# Altium schematic sheet Amp_schem.SchDoc
size A3; SheetNumber: 1; SheetTotal: 1
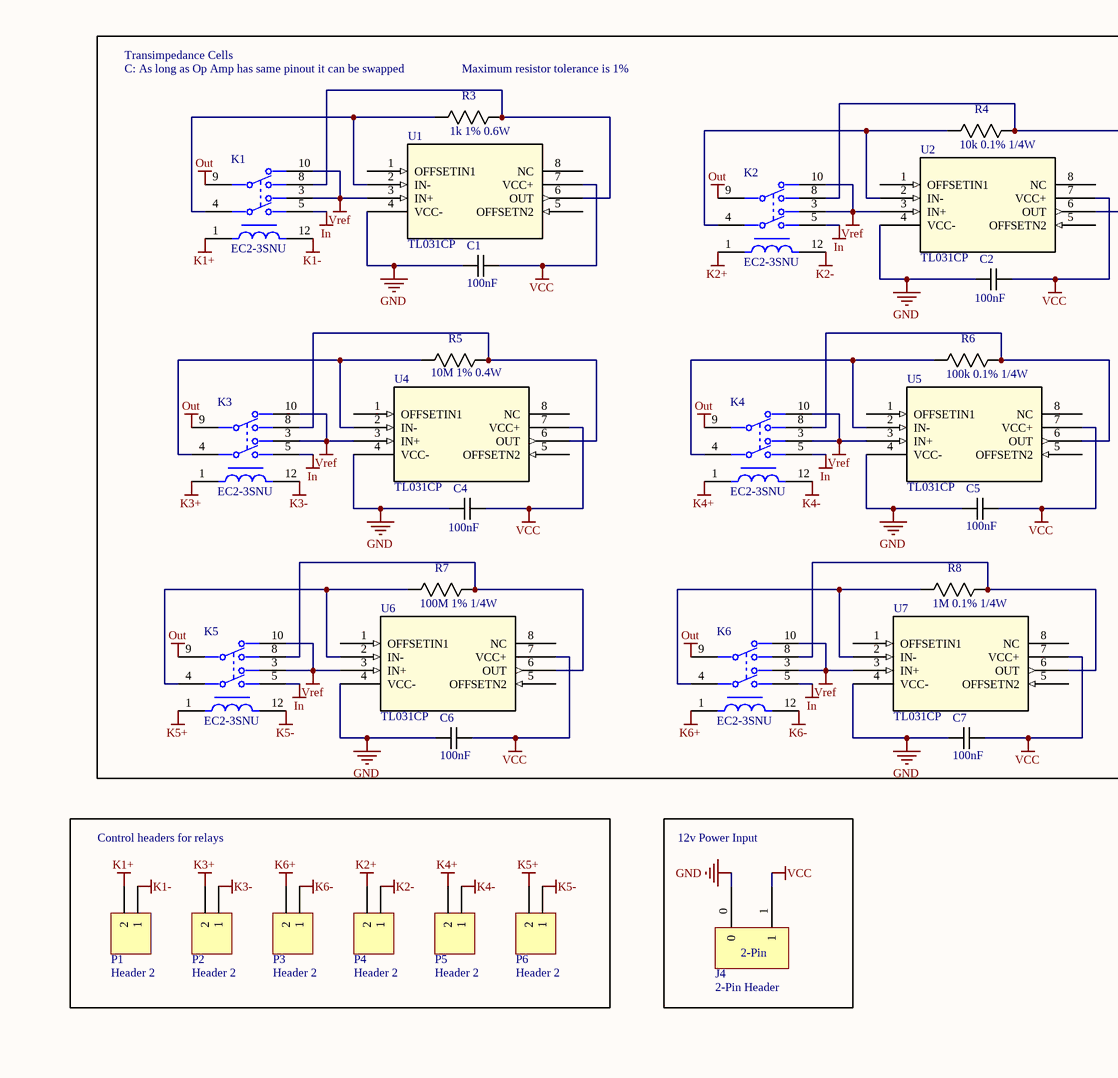
[diagram p0: Amp_schem.SchDoc, top left]
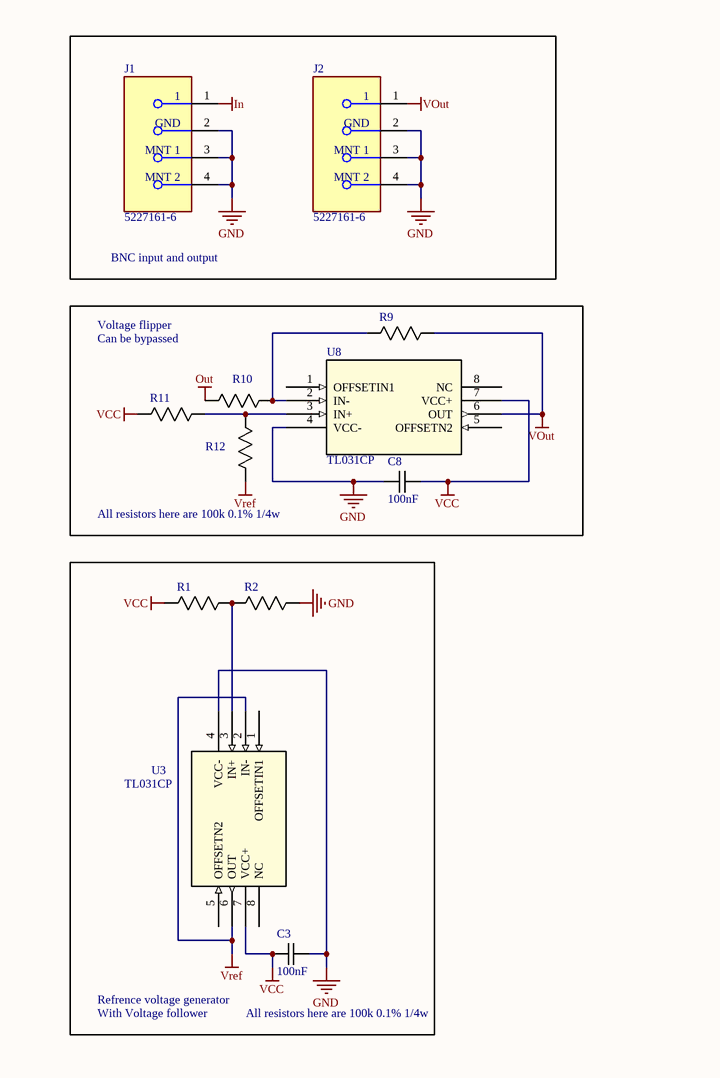
[diagram p1: Amp_schem.SchDoc, top right]
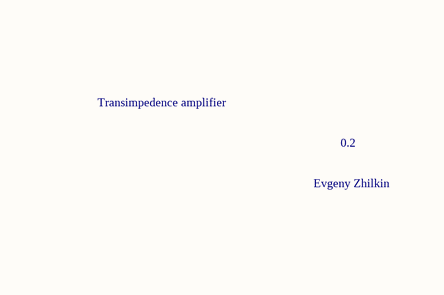
[diagram p2: Amp_schem.SchDoc, bottom right]

## Parts
C1  100nF  [Resistor 1/4]
C2  100nF  [Resistor 1/4]
C3  100nF  [Resistor 1/4]
C4  100nF  [Resistor 1/4]
C5  100nF  [Resistor 1/4]
C6  100nF  [Resistor 1/4]
C7  100nF  [Resistor 1/4]
C8  100nF  [Resistor 1/4]
J1  5227161-6  [FP-5227161-6-MFG]
J2  5227161-6  [FP-5227161-6-MFG]
J4  2-Pin Header  [HDR1X2]
K1  EC2-3SNU  [Relay]
K2  EC2-3SNU  [Relay]
K3  EC2-3SNU  [Relay]
K4  EC2-3SNU  [Relay]
K5  EC2-3SNU  [Relay]
K6  EC2-3SNU  [Relay]
P1  Header 2  [HDR1X2]
P2  Header 2  [HDR1X2]
P3  Header 2  [HDR1X2]
P4  Header 2  [HDR1X2]
P5  Header 2  [HDR1X2]
P6  Header 2  [HDR1X2]
R1  100k 0.1% 1/4w  [Resistor 0.4W]  (value not drawn)
R2  100k 0.1% 1/4w  [Resistor 0.4W]  (value not drawn)
R3  1k 1% 0.6W  [Resistor 0.4W]
R4  10k 0.1% 1/4W  [Resistor 0.4W]
R5  10M 1% 0.4W  [Resistor 0.4W]
R6  100k 0.1% 1/4W  [Resistor 0.4W]
R7  100M 1% 1/4W  [Resistor 0.4W]
R8  1M 0.1% 1/4W  [Resistor 0.4W]
R9  100k 0.1% 1/4w  [Resistor 0.4W]  (value not drawn)
R10  100k 0.1% 1/4w  [Resistor 0.4W]  (value not drawn)
R11  100k 0.1% 1/4w  [Resistor 0.4W]  (value not drawn)
R12  100k 0.1% 1/4w  [Resistor 0.4W]  (value not drawn)
U1  TL031CP  [P8]
U2  TL031CP  [P8]
U3  TL031CP  [P8]
U4  TL031CP  [P8]
U5  TL031CP  [P8]
U6  TL031CP  [P8]
U7  TL031CP  [P8]
U8  TL031CP  [P8]

## Blocks framed on the sheet
BNC input and output: J1 J2
Control headers for relays: P1-P6
12v Power Input: J4

## Nets
GND: C1.1 C2.1 C3.2 C4.1 C5.1 C6.1 C7.1 C8.1 J1.2(GND) J1.3(MNT_1) J1.4(MNT_2) J2.2(GND) J2.3(MNT_1) J2.4(MNT_2) J4.0 R2.2 U1.4(VCC-) U2.4(VCC-) U3.4(VCC-) U4.4(VCC-) U5.4(VCC-) U6.4(VCC-) U7.4(VCC-) U8.4(VCC-)
In: J1.1 K1.5 K2.5 K3.5 K4.5 K5.5 K6.5
K1+: K1.1 P1.2
K1-: K1.12 P1.1
K2+: K2.1 P4.2
K2-: K2.12 P4.1
K3+: K3.1 P2.2
K3-: K3.12 P2.1
K4+: K4.1 P5.2
K4-: K4.12 P5.1
K5+: K5.1 P6.2
K5-: K5.12 P6.1
K6+: K6.1 P3.2
K6-: K6.12 P3.1
Out: K1.9 K2.9 K3.9 K4.9 K5.9 K6.9 R10.1
VCC: C1.2 C2.2 C3.1 C4.2 C5.2 C6.2 C7.2 C8.2 J4.1 R1.1 R11.1 U1.7(VCC+) U2.7(VCC+) U3.7(VCC+) U4.7(VCC+) U5.7(VCC+) U6.7(VCC+) U7.7(VCC+) U8.7(VCC+)
VOut: J2.1 R9.2 U8.6(OUT)
Vref: K1.3 K1.10 K2.3 K2.10 K3.3 K3.10 K4.3 K4.10 K5.3 K5.10 K6.3 K6.10 R12.1 U1.3(IN+) U2.3(IN+) U3.2(IN-) U3.6(OUT) U4.3(IN+) U5.3(IN+) U6.3(IN+) U7.3(IN+)
NetK1_4: K1.4 R3.1 U1.2(IN-)
NetK1_8: K1.8 R3.2 U1.6(OUT)
NetK2_4: K2.4 R4.1 U2.2(IN-)
NetK2_8: K2.8 R4.2 U2.6(OUT)
NetK3_4: K3.4 R5.1 U4.2(IN-)
NetK3_8: K3.8 R5.2 U4.6(OUT)
NetK4_4: K4.4 R6.1 U5.2(IN-)
NetK4_8: K4.8 R6.2 U5.6(OUT)
NetK5_4: K5.4 R7.1 U6.2(IN-)
NetK5_8: K5.8 R7.2 U6.6(OUT)
NetK6_4: K6.4 R8.1 U7.2(IN-)
NetK6_8: K6.8 R8.2 U7.6(OUT)
NetR1_2: R1.2 R2.1 U3.3(IN+)
NetR9_1: R9.1 R10.2 U8.2(IN-)
NetR11_2: R11.2 R12.2 U8.3(IN+)

Not connected (* = marked no-connect by the designer): U1 1(OFFSETIN1) 5(OFFSETN2) 8(NC); U2 1(OFFSETIN1) 5(OFFSETN2) 8(NC); U3 1(OFFSETIN1) 5(OFFSETN2) 8(NC); U4 1(OFFSETIN1) 5(OFFSETN2) 8(NC); U5 1(OFFSETIN1) 5(OFFSETN2) 8(NC); U6 1(OFFSETIN1) 5(OFFSETN2) 8(NC); U7 1(OFFSETIN1) 5(OFFSETN2) 8(NC); U8 1(OFFSETIN1) 5(OFFSETN2) 8(NC)

## Notes on the sheet
- Transimpedance Cells
- (near R3) C: As long as Op Amp has same pinout it can be swapped
- (near R3) Maximum resistor tolerance is 1%
- Voltage flipper
- Can be bypassed
- (near R12) All resistors here are 100k 0.1% 1/4w
- (near C3) Refrence voltage generator
- With Voltage follower
- All resistors here are 100k 0.1% 1/4w
- Transimpedence amplifier
- 0.2
- Evgeny Zhilkin
- (in symbol 2-Pin Header) 2-Pin

## Library data of the parts
C1-C8 = Cap
J1 J2 = CMP-03790-39546762-1: 5227161-6 RF Connector, BNC, Jack, 50 Ohm, Right Angle PCB Mount, Commecial Grade; Manufacturer Lifecycle Status: ACTIVE; Insulation Resistance: 5GΩ; Sealable: No; Max Frequency: 4GHz; Body Plating: Nickel; Dielectric Material: Polymethylpentene; Tail Length: 4.11mm; Number of Positions: 1; Polarity: Normal, Standard; Body Material: Zinc; Voltage Rating: 500V; Gender: Female; Impedance: 50Ω; Outside Diameter: 14.529mm; Lifecycle Status: Production; Orientation: Right Angle; Mount: Panel; Packaging: Bulk; Frequency: 4GHz; Color: Black; Height: 16.13mm; NexarPartId: 39546762; Lead Free: Lead Free; Termination: Solder, Through Hole; Connector Type: BNC; Housing Color: Black; Fastening Type: Bayonet; Radiation Hardening: No; Depth: 34.93mm; PCB Mounting Orientation: Right Angle; Contact Material: Gold; Housing Material: Polyester; Contact Plating: Gold; RoHS: Compliant; Min Operating Temperature: -55°C; Number of Contacts: 1; Max Operating Temperature: 85°C; Insulation Material: Polymethylpentene; Length: 34.93mm; REACH SVHC: No SVHC
K1-K6 = Relay: Supplier 1: Digikey; Supplier Part Number 1: 399-11043-5-ND
  K1: Parameter 1: *; ComponentLink1Description: New link; ComponentLink1URL: *
P1-P6 = Header 2: Header, 2-Pin; LatestRevisionDate: 17-Jul-2002; LatestRevisionNote: Re-released for DXP Platform.; Publisher: Altium Limited
R1 R2 R6 R9-R12 = Resistor 1/4W: Mfr_Name: Vishay; Part_Name: MF1/4CCT52R1003B; Supplier 1: Digikey; Supplier Part Number 1: 2019-MF1/4CCT52R1003BCT-ND
R3 = Resistor 1/4W: Mfr_Name: Vishay; Part_name: LR1F1K0; Supplier 1: Digikey; Supplier Part Number 1: A105951CT-ND
R4 = Resistor 1/4W: Mfr_Name: Vishay; Part_name: MF1/4CCT52R1002B; Supplier 1: Digikey; Supplier Part Number 1: 2019-MF1/4CCT52R1002BCT-ND
R5 = Resistor 1/4W: Mfr_Name: Vishay; Part_Name: MBA02040C1005FCT00; Supplier 1: Digikey; Supplier Part Number 1: 56-MBA02040C1005FCT00CT-ND
R7 = Resistor 1/4W: Mfr_Name: Vishay; Part_Name: HVA05FA500M; Supplier 1: Digikey; Supplier Part Number 1: HVA05FA500MCT-ND
R8 = Resistor 1/4W: Mfr_Name: Vishay; Part_Name: RN60C1004BRE6; Supplier 1: Digikey; Supplier Part Number 1: 541-RN60C1004BRE6CT-ND
U1-U8 = TL031CP: No Description Available; Mfr_Name: Texas Instruments; RefDes: RefDes; Type: Type; Supplier 1: Digikey; Supplier Part Number 1: 296-7144-5-ND